# Altium schematic sheet Power Circuit.SchDoc
size A3; SheetNumber: 4; SheetTotal: 7
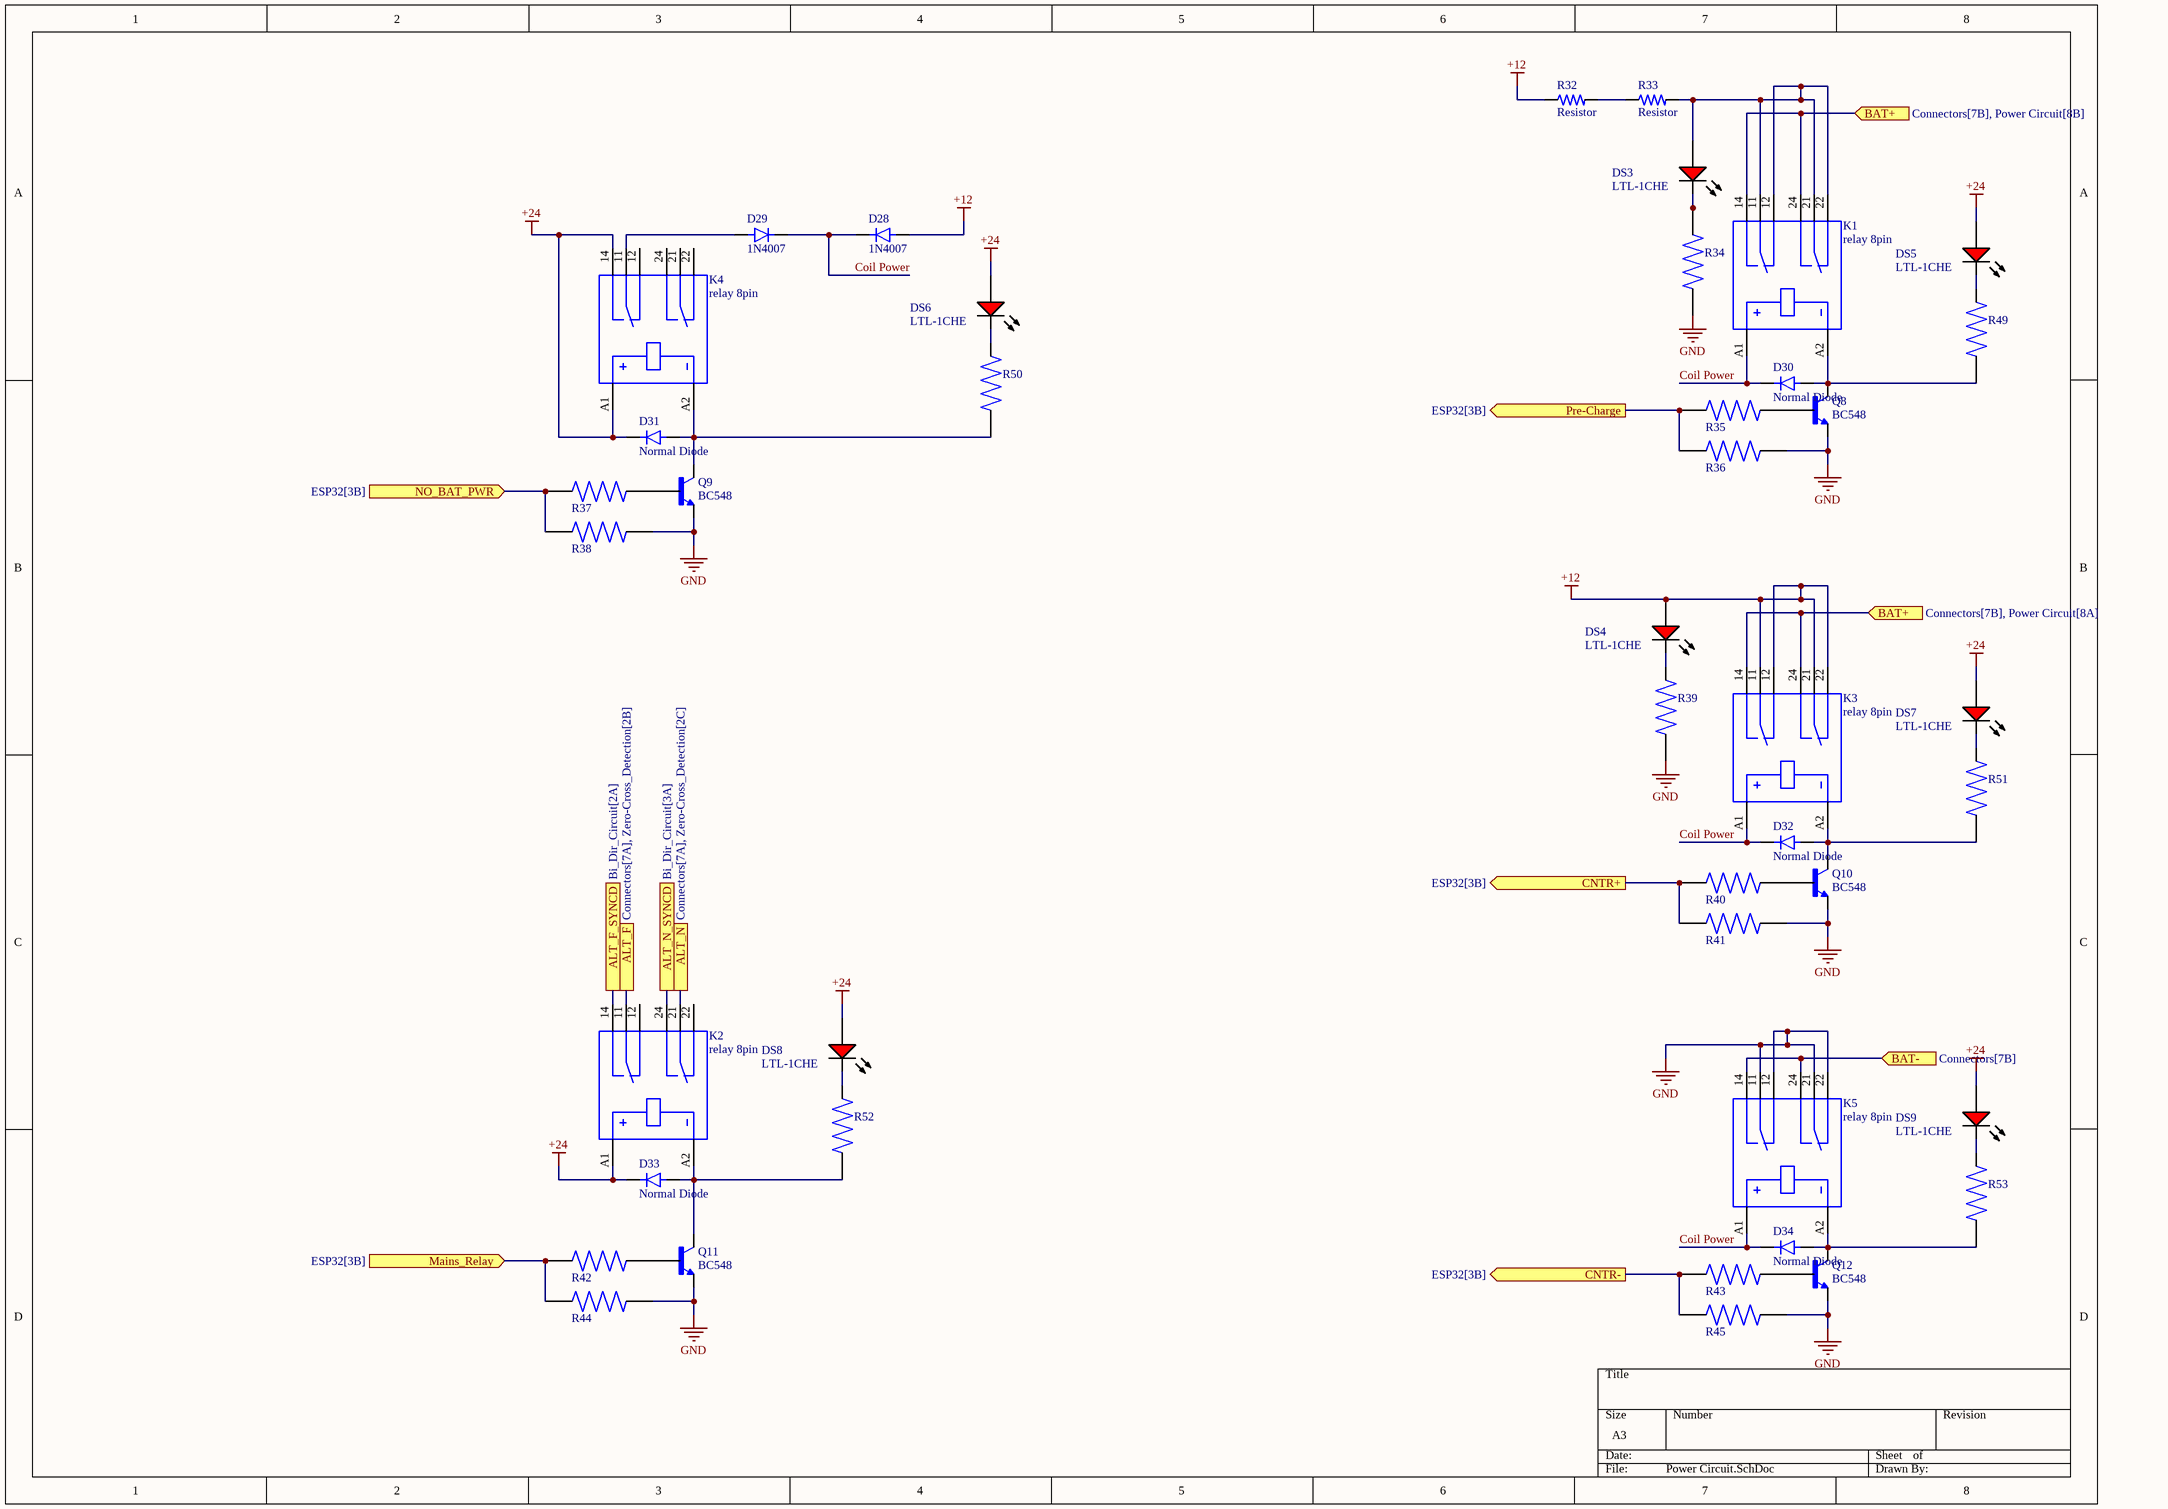
[diagram p0: Power Circuit.SchDoc]

## Parts
D28  1N4007  [Common Trhough Hole]
D29  1N4007  [Common Trhough Hole]
D30  Normal Diode  [Common Trhough Hole]
D31  Normal Diode  [Common Trhough Hole]
D32  Normal Diode  [Common Trhough Hole]
D33  Normal Diode  [Common Trhough Hole]
D34  Normal Diode  [Common Trhough Hole]
DS3  LTL-1CHE  [LED3mm]
DS4  LTL-1CHE  [LED3mm]
DS5  LTL-1CHE  [LED3mm]
DS6  LTL-1CHE  [LED3mm]
DS7  LTL-1CHE  [LED3mm]
DS8  LTL-1CHE  [LED3mm]
DS9  LTL-1CHE  [LED3mm]
K1  relay 8pin  [Relay socket 8pin]
K2  relay 8pin  [Relay socket 8pin]
K3  relay 8pin  [Relay socket 8pin]
K4  relay 8pin  [Relay socket 8pin]
K5  relay 8pin  [Relay socket 8pin]
Q8  BC548  [bc548]
Q9  BC548  [bc548]
Q10  BC548  [bc548]
Q11  BC548  [bc548]
Q12  BC548  [bc548]
R32  Resistor  [Resistor_Through Hole]
R33  Resistor  [Resistor_Through Hole]
R34  Resistor_Through Hole  [Resistor_Through Hole]  (value not drawn)
R35  Resistor_Through Hole  [Resistor_Through Hole]  (value not drawn)
R36  Resistor_Through Hole  [Resistor_Through Hole]  (value not drawn)
R37  Resistor_Through Hole  [Resistor_Through Hole]  (value not drawn)
R38  Resistor_Through Hole  [Resistor_Through Hole]  (value not drawn)
R39  Resistor_Through Hole  [Resistor_Through Hole]  (value not drawn)
R40  Resistor_Through Hole  [Resistor_Through Hole]  (value not drawn)
R41  Resistor_Through Hole  [Resistor_Through Hole]  (value not drawn)
R42  Resistor_Through Hole  [Resistor_Through Hole]  (value not drawn)
R43  Resistor_Through Hole  [Resistor_Through Hole]  (value not drawn)
R44  Resistor_Through Hole  [Resistor_Through Hole]  (value not drawn)
R45  Resistor_Through Hole  [Resistor_Through Hole]  (value not drawn)
R49  Resistor_Through Hole  [Resistor_Through Hole]  (value not drawn)
R50  Resistor_Through Hole  [Resistor_Through Hole]  (value not drawn)
R51  Resistor_Through Hole  [Resistor_Through Hole]  (value not drawn)
R52  Resistor_Through Hole  [Resistor_Through Hole]  (value not drawn)
R53  Resistor_Through Hole  [Resistor_Through Hole]  (value not drawn)

## Ports
ALT_F (see Connectors[7A], Zero-Cross_Detection[2B]), ALT_F_SYNCD (see Bi_Dir_Circuit[2A]), ALT_N (see Connectors[7A], Zero-Cross_Detection[2C]), ALT_N_SYNCD (see Bi_Dir_Circuit[3A]), BAT+ (in, see Connectors[7B], Power Circuit[8A]), BAT+ (in, see Connectors[7B], Power Circuit[8B]), BAT- (in, see Connectors[7B]), CNTR+ (out, see ESP32[3B]), CNTR- (out, see ESP32[3B]), Mains_Relay (in, see ESP32[3B]), NO_BAT_PWR (in, see ESP32[3B]), Pre-Charge (out, see ESP32[3B])

## Nets
+12: D28.2(A) DS4.1(A) K3.11 K3.12 K3.21 K3.22 R32.1
+24: D31.1(K) D33.1(K) DS5.1(A) DS6.1(A) DS7.1(A) DS8.1(A) DS9.1(A) K2.A1 K4.14 K4.A1
GND: K5.11 K5.12 K5.21 K5.22 Q8.3(E) Q9.3(E) Q10.3(E) Q11.3(E) Q12.3(E) R34.2 R36.1 R38.1 R39.2 R41.1 R44.1 R45.1
ALT_F: K2.11 ; port ALT_F
ALT_F_SYNCD: K2.14 ; port ALT_F_SYNCD
ALT_N: K2.21 ; port ALT_N
ALT_N_SYNCD: K2.24 ; port ALT_N_SYNCD
BAT+: K1.14 K1.24 K3.14 K3.24 ; port BAT+
BAT-: K5.14 K5.24 ; port BAT-
CNTR+: R40.2 R41.2 ; port CNTR+
CNTR-: R43.2 R45.2 ; port CNTR-
Coil Power: D28.1(K) D29.1(K) D30.1(K) D32.1(K) D34.1(K) K1.A1 K3.A1 K5.A1
Mains_Relay: R42.2 R44.2 ; port Mains_Relay
NO_BAT_PWR: R37.2 R38.2 ; port NO_BAT_PWR
Pre-Charge: R35.2 R36.2 ; port Pre-Charge
NetD29_2: D29.2(A) K4.11
NetD30_2: D30.2(A) K1.A2 Q8.1(C) R49.2
NetD31_2: D31.2(A) K4.A2 Q9.1(C) R50.2
NetD32_2: D32.2(A) K3.A2 Q10.1(C) R51.2
NetD33_2: D33.2(A) K2.A2 Q11.1(C) R52.2
NetD34_2: D34.2(A) K5.A2 Q12.1(C) R53.2
NetDS3_1: DS3.1(A) K1.11 K1.12 K1.21 K1.22 R33.2
NetDS3_2: DS3.2(K) R34.1
NetDS4_2: DS4.2(K) R39.1
NetDS5_2: DS5.2(K) R49.1
NetDS6_2: DS6.2(K) R50.1
NetDS7_2: DS7.2(K) R51.1
NetDS8_2: DS8.2(K) R52.1
NetDS9_2: DS9.2(K) R53.1
NetQ8_2: Q8.2(B) R35.1
NetQ9_2: Q9.2(B) R37.1
NetQ10_2: Q10.2(B) R40.1
NetQ11_2: Q11.2(B) R42.1
NetQ12_2: Q12.2(B) R43.1
NetR32_2: R32.2 R33.1

Not connected (* = marked no-connect by the designer): K2 12(7) 22(2); K4 12(7) 21(3) 22(2) 24(4)

## Library data of the parts
D28 D29 = Normal Diode: MF: NTE Electronics, Inc.; Package: DO-41 NTE Electronics; Check_prices: https://www.snapeda.com/parts/1N4007/NTE+Electronics/view-part/?ref=eda; Value: *; Purchase-URL: https://pricing.snapeda.com/search/part/1N4007/?ref=eda; Availability: In Stock; SnapEDA_Link: https://www.snapeda.com/parts/1N4007/NTE+Electronics/view-part/?ref=snap; MP: 1N4007; Price: None
D30-D34 = Normal Diode: MF: NTE Electronics, Inc.; MP: 1N4007; Package: DO-41 NTE Electronics; Check_prices: https://www.snapeda.com/parts/1N4007/NTE+Electronics/view-part/?ref=eda; Value: *; Purchase-URL: https://pricing.snapeda.com/search/part/1N4007/?ref=eda; Availability: In Stock; SnapEDA_Link: https://www.snapeda.com/parts/1N4007/NTE+Electronics/view-part/?ref=snap; Price: None
DS3-DS9 = RED_LED 3mm: Radial LED, 12.6 mcd, 20 mA, 2 V, -55 to 100 degC, 2-Pin THD, RoHS, Bulk; Shielding: Unshielded; Resistance: 0.045 Ohm; Current Rating: 3.6 A; Tolerance: 20%; PackageReference: LTL-1CHE; PackageDescription: 2-Pin Through Hole Device, Dia 3.8 mm, Pitch 2.54 mm; Case\Package: Radial; Length: 0.97 inch; Width: 0.62 inch; Height: 1.1 inch; Radiation Hardening: No; Lead Pitch: 11.44 mm; ComponentLink1URL: http://www.us.liteon.com/; ComponentLink1Description: Manufacturer URL; RoHSCompliant: true; Packaging: Tray; Mount: Through Hole; Min Operating Temperature: -40 degC; Max Operating Temperature: 130 degC; ComponentLink2URL: https://datasheet.ciiva.com/15117/getdatasheetpartid-187746-15117985.pdf; Package Quantity: 55; ComponentLink2Description: Datasheet; DatasheetVersion: Dec-03
K1-K5 = relay 8pin: General Purpose Relay DPDT _2 Form C_ 24VDC Coil Through Hole; MF: TE Connectivity; MP: 1-1393243-0; Package: None; Value: *; Availability: Unavailable; SnapEDA_Link: https://www.snapeda.com/parts/1-1393243-0/TE%20Connectivity%20Potter%20&%20Brumfield%20Relays/view-part/244556/?ref=snap; Price: None
Q8-Q12 = BC548: Bipolar (BJT) Transistor NPN 30V 100mA 300MHz 500mW Through Hole TO-92-3; MF: ON Semiconductor; DigiKey-Purchase-URL: https://snapeda.com/shop?store=DigiKey&id=2007035; MP: BC548; Availability: Warning; Package: TO-92 ON Semiconductor; Value: *; SnapEDA_Link: https://www.snapeda.com/parts/BC548/ON%20Semiconductor/view-part/2007035/?ref=snap; Price: None
R32 R33 = Resistor: Power_Rating: .25 W; MP: 2-2176053-0; Tolerance: 1%; Resistance: .33; MF: TE Connectivity; Price: None; Availability: In Stock; EU_RoHS_Compliance: Compliant with Exemptions; Package: 0805; Value: *; SnapEDA_Link: https://www.snapeda.com/parts/2-2176053-0/TE+Connectivity/view-part/?ref=snap; Check_prices: https://www.snapeda.com/parts/2-2176053-0/TE+Connectivity/view-part/?ref=eda
R34-R45 R49-R53 = Resistor_Through Hole: 1.02 Ohms Â±1% 0.25W, 1/4W Through Hole Resistor Axial Metal Film; MP: MFR-25FTE52-1R; MF: Yageo; Availability: Warning; Value: *; Check_prices: https://www.snapeda.com/parts/MFR-25FTE52-1R/Yageo/view-part/4629919/?ref=eda; Package: Axial Yageo; Price: None; SnapEDA_Link: https://www.snapeda.com/parts/MFR-25FTE52-1R/Yageo/view-part/4629919/?ref=snap; Purchase-URL: https://pricing.snapeda.com/search/part/MFR-25FTE52-1R/?ref=eda